# EasyEDA Pro project CH585M-R1(3)(1)(5).eprj, board CH585M-R1-1v1 (3)
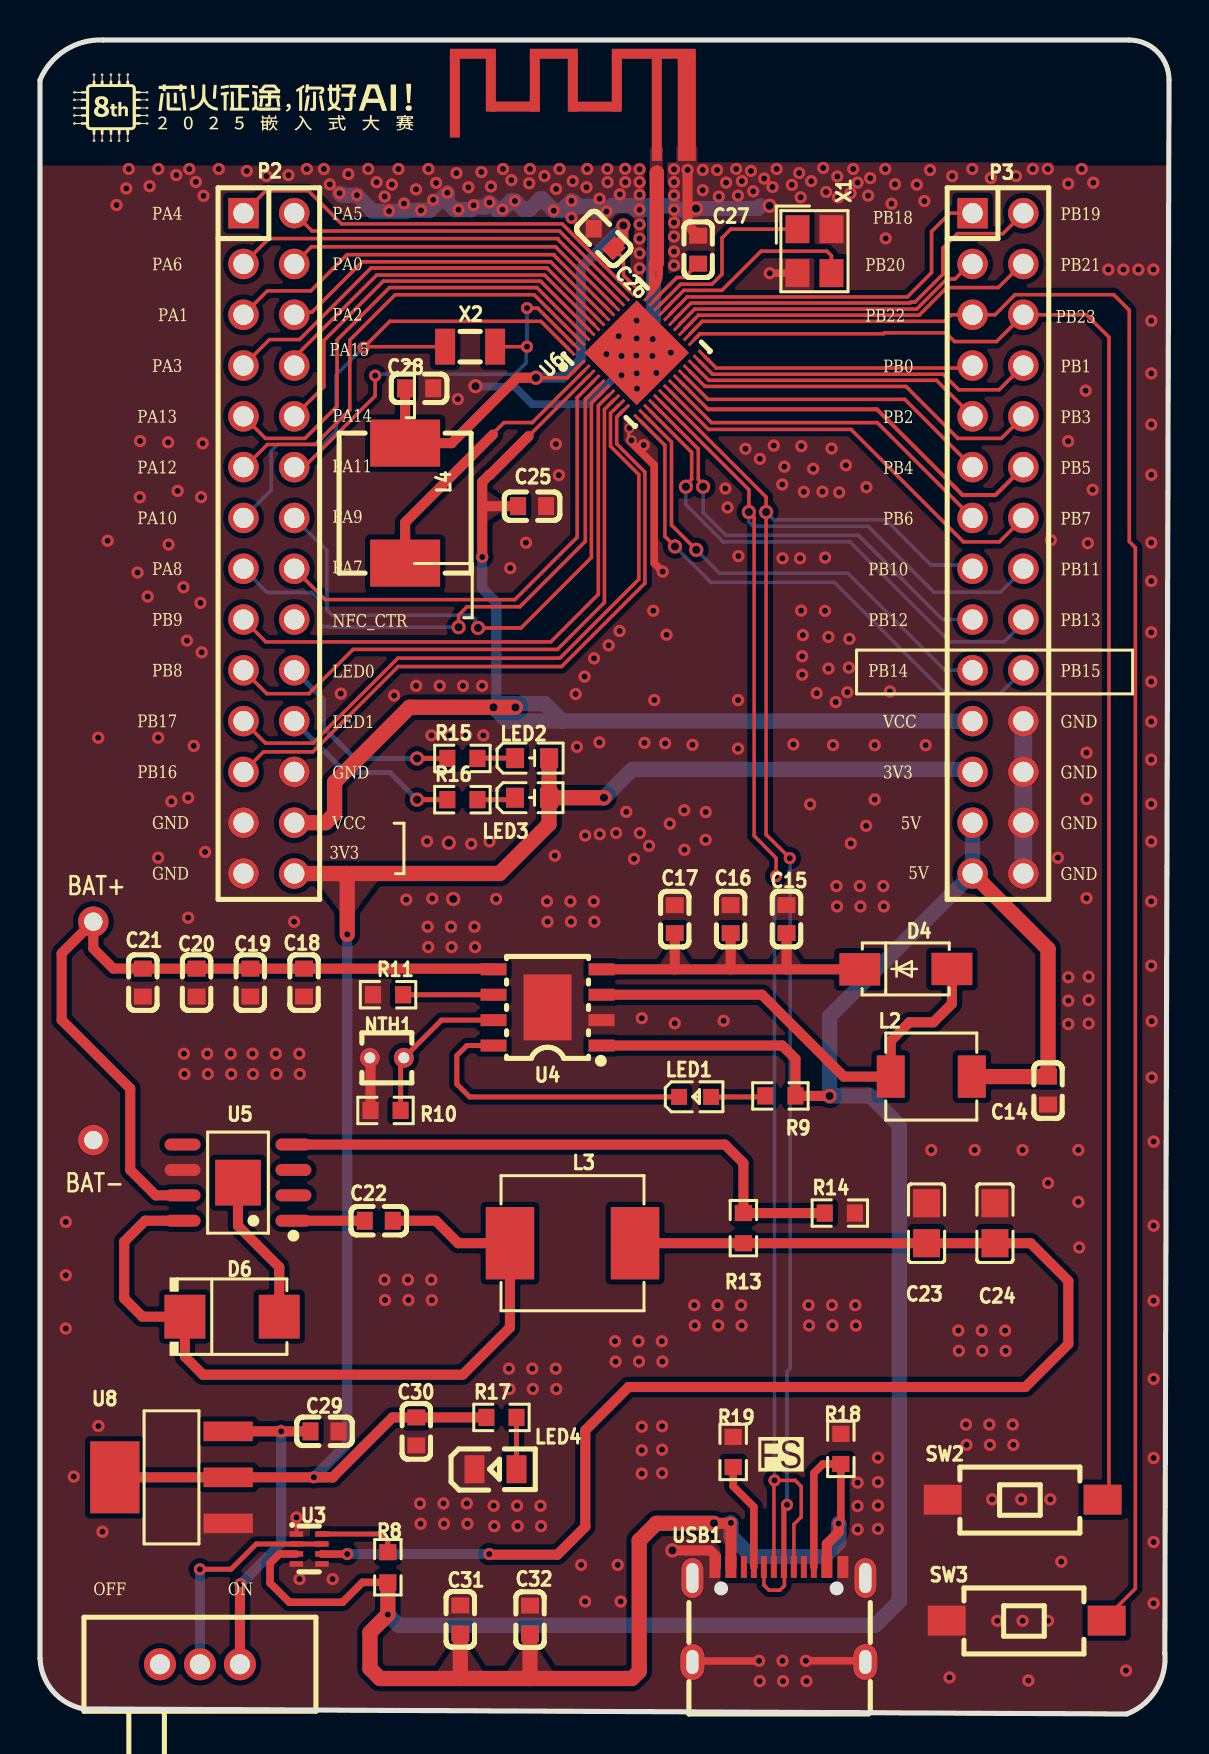
[diagram p4: board, top side]
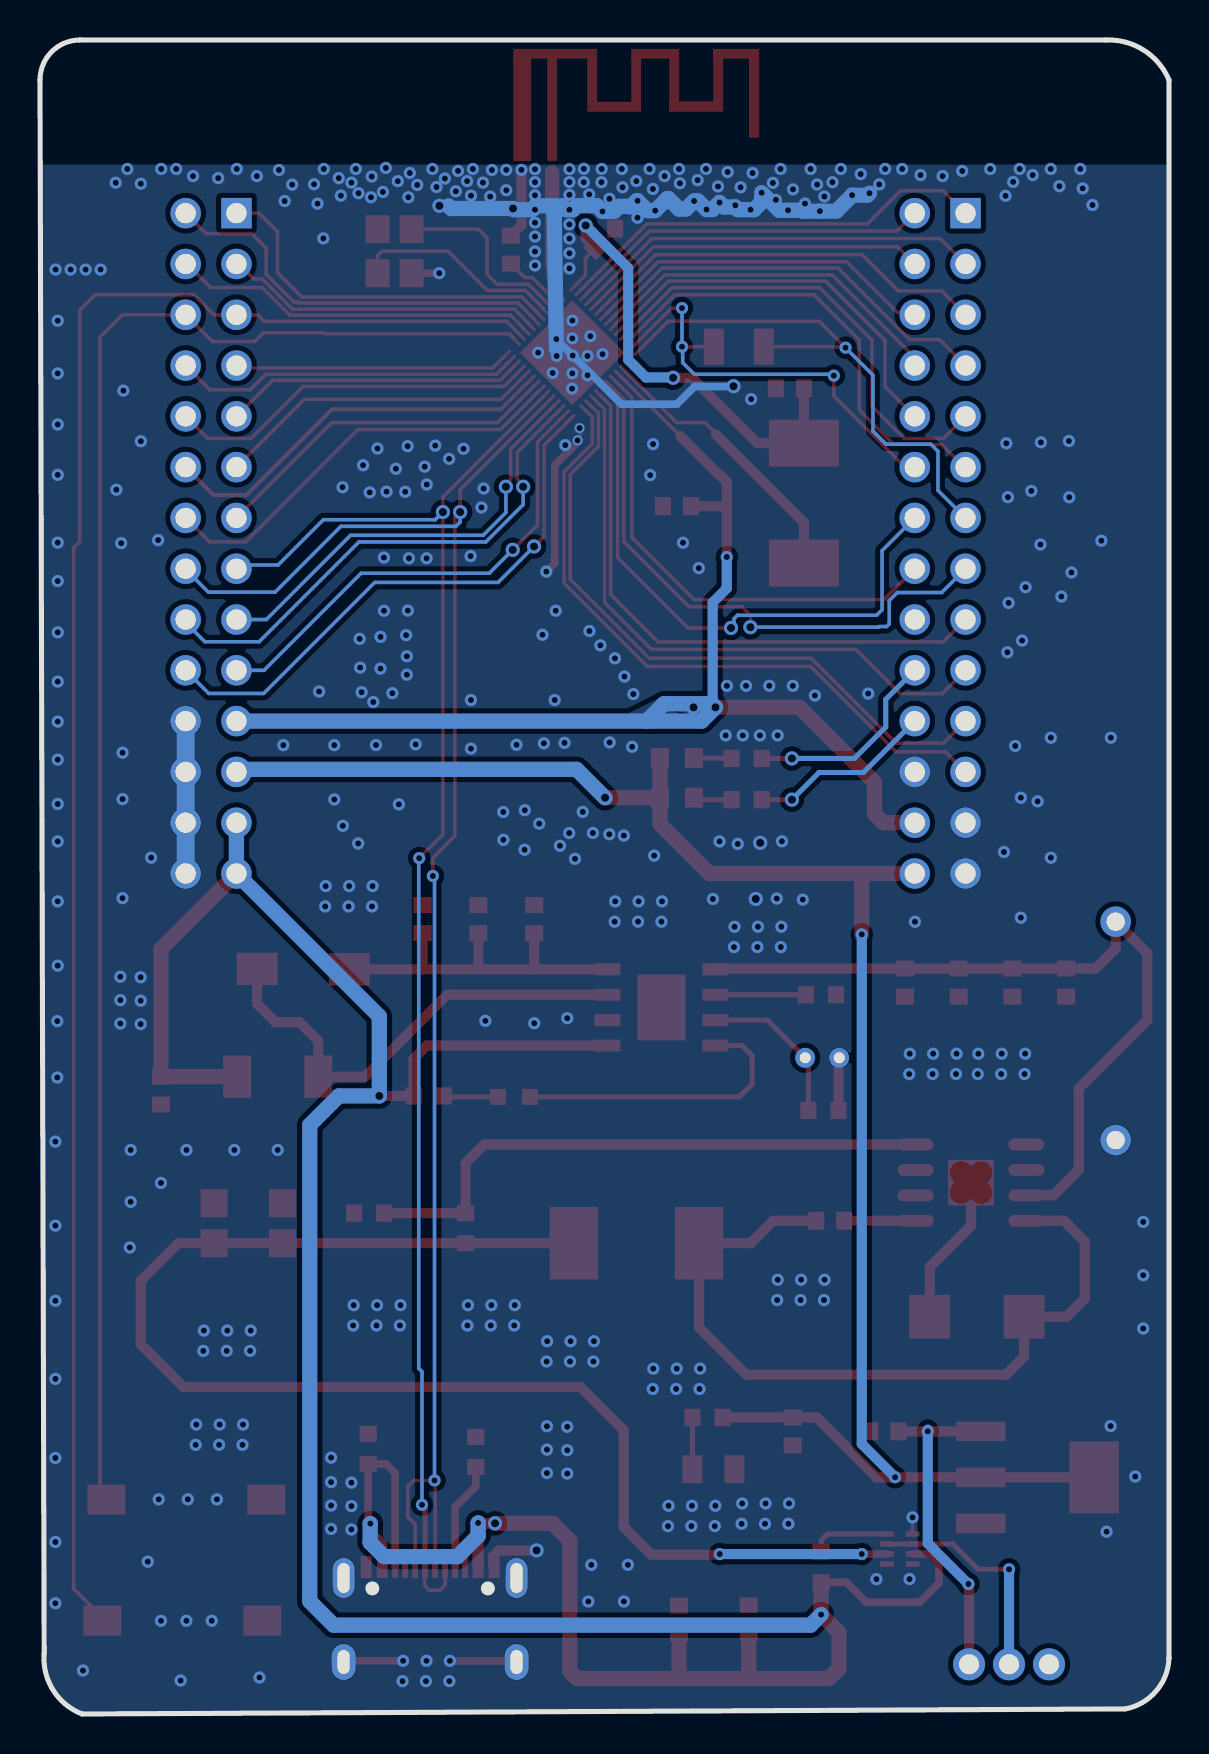
[diagram p5: board, bottom side, seen from below]

Outline 56.47 x 83.71 mm; copper layers: Top Layer, Bottom Layer. Coordinates in mm from the lower left corner of the outline.
Outline path: 0,81.71 arc(1.27,83.21) 3.16,83.71 54.47,83.71 arc(55.88,83.12) 56.47,81.71 56.26,3.05 arc(55.82,1.21) 54.36,0 2.18,0.25 arc(0.65,1.14) 0,2.79 0,81.71
Stack: Top Layer 0.0356mm / Dielectric1 0.32mm FR-4 er 4.8 / Bottom Layer 0.0356mm

## Design rules (mm)
net C3: CH585M-R1-1v1
net C5: CH585M-R1-1v1
net C7: CH585M-R1-1v1
net C8: CH585M-R1-1v1
net C11: CH585M-R1-1v1
net F1: CH585M-R1-1v1
net L1: CH585M-R1-1v1
net P2: CH585M-R1-1v1
net P3: CH585M-R1-1v1
net R1: CH585M-R1-1v1
net R2: CH585M-R1-1v1
net R3: CH585M-R1-1v1
net U1: CH585M-R1-1v1
net Y1: CH585M-R1-1v1
net Y2: CH585M-R1-1v1
net E1: CH585M-R1-1v1
net R4: CH585M-R1-1v1
net R7: CH585M-R1-1v1
net S1: CH585M-R1-1v1
net S2: CH585M-R1-1v1
net S3: CH585M-R1-1v1
net C1: CH585M-R1-1v1
net D1: CH585M-R1-1v1
net D2: CH585M-R1-1v1
net D3: CH585M-R1-1v1
net P4: CH585M-R1-1v1
net R8: CH585M-R1-1v1
net R11: CH585M-R1-1v1
net P1: CH585M-R1-1v1
net U2: CH585M-R1-1v1
net C4: CH585M-R1-1v1
net C6: CH585M-R1-1v1
net C9: CH585M-R1-1v1
net C10: CH585M-R1-1v1
net C12: CH585M-R1-1v1
net C13: CH585M-R1-1v1
net C14: CH585M-R1-1v1
net C15: CH585M-R1-1v1
net C16: CH585M-R1-1v1
net C17: CH585M-R1-1v1
net L2: CH585M-R1-1v1
net L3: CH585M-R1-1v1
net R12: CH585M-R1-1v1
net R13: CH585M-R1-1v1
net R14: CH585M-R1-1v1
net R15: CH585M-R1-1v1
net R16: CH585M-R1-1v1
net C2: CH585M-R1-1v1
net R17: CH585M-R1-1v1
net PB12: NewDifferentialPair2
net PB13: NewDifferentialPair2
net PB11: NewDifferentialPair1
net PB10: NewDifferentialPair1
spacing Clearance_1: track to track 0.152, other pairs 0.152 to 0.152
spacing Clearance (default): track to track 0.127, other pairs 0 to 0.152
spacing Clearance_3: track to track 0.254, other pairs 0 to 0.254
track width Width (default): min 0.127, default 0.178, max 1.27
differential pair DiffPairsRouting (default): width min 0.178, default 0.381, max 0.381; gap min 0.152, default 0.254
via RoutingVias (default): diameter min 0.508, default 0.61, max 1.27; hole min 0.305, default 0.305, max 0.711
net ANT uses Clearance_1

## Placement (name value [footprint] x y rotation side)
C14  100nF  [C0603#2]  50.42 31.17 90 top
C15  10uF  [C0603#2]  37.34 39.75 270 top
C16  10uF  [C0603#2]  34.54 39.75 270 top
C17  10uF  [C0603#2]  31.75 39.75 270 top
C18  10uF  [C0603#2]  13.21 36.57 90 top
C19  10uF  [C0603#2]  10.52 36.57 90 top
C20  10uF  [C0603#2]  7.83 36.57 90 top
C21  10uF  [C0603#2]  5.15 36.57 90 top
C22  100nF  [C0603#2]  16.95 24.67 0 top
C23  22uF  [C0805]  44.34 24.54 90 top
C24  22uF  [C0805]  47.76 24.54 90 top
C25  2.2uF  [C0603#2]  24.61 60.4 180 top
C26  100nF  [C0603]  28.19 73.78 135 top
C27  470nF  [C0603#2]  32.92 73.23 270 top
C28  4.7uF  [C0603#2]  18.96 66.29 180 top
C29  10uF  [C0603#2]  14.23 14.13 180 top
C30  22uF  [C0603#2]  18.82 14.13 90 top
C31  22uF  [C0603#2]  21.02 4.73 270 top
C32  22uF  [C0603#2]  24.51 4.72 270 top
D4  SS54  [SMA_L4.3-W2.6-LS5.0-FD]  43.31 37.25 180 top
D6  SS54SMB  [SMB_L4.6-W3.6-LS5.3-RD]  9.61 19.87 0 top
E1  F  [ANT-F-1-2.4G-1.6mmFR4]  30.86 77.98 0 top
L2  2.2uH  [IND-SMD_L4.4-W4.2]  44.58 31.87 0 top
L3  15uH  [IND-SMD_L7.0-W6.6_FXL0630]  26.64 23.54 180 top
L4  10uH  [IND-SMD_L7.3-W6.8]  18.26 60.55 90 top
LED1  LTST-C190KSKT  [LED0603-RD]  32.77 30.86 0 top
LED2  YLED0603B  [LED0603-FD]  24.61 45.82 180 top
LED3  YLED0603R  [LED0603-FD]  24.61 47.8 180 top
LED4  NCD0805R1  [LED0805-R-RD]  22.78 12.24 0 top
NOREF  -  [Pad_e2906]  2.67 39.62 0 top
NOREF#2  -  [Pad_e2948]  2.67 28.7 0 top
NTH1  100K  [RES-TH_L2.5-W2.5-P1.70-D0.3]  17.35 32.81 180 top
P2  HEADER 14x2  [IDC28-2.54MM]  10.18 75.05 0 top
P3  HEADER 14x2  [IDC28-2.54MM]  46.64 75.05 0 top
R8  10kΩ  [R0603]  17.4 7.34 270 top
R9  1kΩ  [R0603]  37.03 30.91 180 top
R10  82kΩ  [R0603]  17.28 30.18 180 top
R11  1kΩ  [R0603]  17.41 35.97 180 top
R13  10kΩ  [R0603]  35.18 24.3 90 top
R14  3.16kΩ  [R0603]  40.01 25.05 0 top
R15  1kΩ  [R0603]  21.13 47.78 0 top
R16  1kΩ  [R0603]  21.13 45.72 0 top
R17  1kΩ  [R0603]  23.08 14.83 0 top
R18  5.1kΩ  [R0603]  40.06 13.26 270 top
R19  5.1kΩ  [R0603]  34.67 13.1 270 top
SW1  SSSS916900  [SW-TH_SSSS916900]  8 2.49 90 top
SW2  TS-1101-C-W  [SW-SMD_L6.0-W3.3-LS8.0]  49.15 10.72 0 top
SW3  TS-1101-C-W  [SW-SMD_L6.0-W3.3-LS8.0]  49.35 4.67 0 top
U3  LM66200DRLR  [SOT-583-8_L2.1-W1.2-P0.50-LS1.6-BL]  13.46 8.25 270 top
U4  SCS5090EA  [ESOP-8_L4.9-W3.9-P1.27-LS6.0-BL-EP3.3]  25.39 35.33 90 top
U5  TPS5450DDAR  [SOP-8_L4.9-W3.9-P1.27-LS6.0-BL-EP]  9.9 26.57 90 top
U6  CH585M  [QFN-48_L5.0-W5.0-P0.35-TL-EP3.7-1]  29.85 68.07 45 top
U8  AMS1117-3.3  [SOT-223-4_L6.5-W3.5-P2.30-LS7.0-BR]  6.58 11.83 0 top
USB1  TYPE-C 16PIN 2MD(073)  [USB-C-SMD_TYPE-C-6PIN-2MD-073]  36.96 4.98 0 top
X1  32MHz  [CRYSTAL-SMD_4P-L3.2-W2.5-BL]  38.73 73.15 270 top
X2  32.768kHz  [FC-135R_L3.2-W1.5]  21.51 68.37 0 top

## Footprints (pads in the part's own frame, mm; a bottom-side part is the same pattern mirrored in y, then rotated)
ANT-F-1-2.4G-1.6mmFR4
  rect 0.8x0.6 smd: 0(1.483,0)
  rect 0.4x0.6 smd: 1(0,0)
C0603
  rect 0.8x0.9 smd: 1(-0.7,0)
  rect 0.8x0.9 smd rot 45: 2(0.7,0)
C0603#2
  rect 0.8x0.9 smd: 1(-0.7,0) 2(0.7,0)
C0805
  rect 1.41x1.35 smd: 1(-1,0) 2(1,0)
CRYSTAL-SMD_4P-L3.2-W2.5-BL
  rect 1.4x1.2 smd: 1(-1.1,-0.85) 2(1.1,-0.85) 3(1.1,0.85) 4(-1.1,0.85)
ESOP-8_L4.9-W3.9-P1.27-LS6.0-BL-EP3.3
  rect 0.6x1.3 smd: 1(-1.905,-2.7) 2(-0.635,-2.7) 3(0.635,-2.7) 4(1.905,-2.7) 5(1.905,2.7) 6(0.635,2.7) 7(-0.635,2.7) 8(-1.905,2.7)
  rect 3.3x2.4 smd: 9(0,0)
FC-135R_L3.2-W1.5
  rect 1x1.8 smd: 1(-1.25,0) 2(1.25,0)
IDC28-2.54MM
  rect 1.524x1.524 hole 1.016: 1(0,0)
  round 1.524 hole 1.016: 2(2.54,0) 3(0,-2.54) 4(2.54,-2.54) 5(0,-5.08) 6(2.54,-5.08) 7(0,-7.62) 8(2.54,-7.62) 9(0,-10.16) 10(2.54,-10.16) 11(0,-12.7) 12(2.54,-12.7) 13(0,-15.24) 14(2.54,-15.24) 15(0,-17.78) 16(2.54,-17.78) 17(0,-20.32) 18(2.54,-20.32) 19(0,-22.86) 20(2.54,-22.86) 21(0,-25.4) 22(2.54,-25.4) 23(0,-27.94) 24(2.54,-27.94) 25(0,-30.48) 26(2.54,-30.48) 27(0,-33.02) 28(2.54,-33.02)
IND-SMD_L4.4-W4.2
  rect 1.4x2.12 smd: 1(2.028,0) 2(-2.028,0)
IND-SMD_L7.0-W6.6_FXL0630
  rect 2.424x3.62 smd: 1(3.128,0) 2(-3.128,0)
IND-SMD_L7.3-W6.8
  rect 2.35x3.5 smd: 1(-3,0) 2(3,0)
LED0603-FD
  rect 0.9x1 smd: 1(-0.85,0) 2(0.85,0)
LED0603-RD
  rect 0.8x0.8 smd: 1(-0.799,0) 2(0.799,0)
LED0805-R-RD
  rect 1x1.399 smd: 1(1.05,0) 2(-1.05,0)
Pad_e2906
  round 1.524 hole 0.914: 1(0,0)
Pad_e2948
  round 1.524 hole 0.914: 1(0,0)
QFN-48_L5.0-W5.0-P0.35-TL-EP3.7-1
  rect 0.8x0.15 smd: 1(-2.5,1.575) 2(-2.5,1.225) 3(-2.5,0.875) 4(-2.5,0.525) 5(-2.5,0.175) 6(-2.5,-0.175) 7(-2.5,-0.525) 8(-2.5,-0.875) 9(-2.5,-1.225) 10(-2.5,-1.575) 25(2.5,-1.575) 26(2.5,-1.225) 27(2.5,-0.875) 28(2.5,-0.525) 29(2.5,-0.175) 30(2.5,0.175) 31(2.5,0.525) 32(2.5,0.875) 33(2.5,1.225) 34(2.5,1.575)
  rect 0.15x0.8 smd: 11(-2.275,-2.5) 12(-1.925,-2.5) 13(-1.575,-2.5) 14(-1.225,-2.5) 15(-0.875,-2.5) 16(-0.525,-2.5) 17(-0.175,-2.5) 18(0.175,-2.5) 19(0.525,-2.5) 20(0.875,-2.5) 21(1.225,-2.5) 22(1.575,-2.5) 23(1.925,-2.5) 24(2.275,-2.5) 35(2.275,2.5) 36(1.925,2.5) 37(1.575,2.5) 38(1.225,2.5) 39(0.875,2.5) 40(0.525,2.5) 41(0.175,2.5) 42(-0.175,2.5) 43(-0.525,2.5) 44(-0.875,2.5) 45(-1.225,2.5) 46(-1.575,2.5) 47(-1.925,2.5) 48(-2.275,2.5)
  rect 3.7x3.7 smd: 49(0.001,0)
R0603
  rect 0.806x0.864 smd: 1(-0.753,0) 2(0.753,0)
RES-TH_L2.5-W2.5-P1.70-D0.3
  round 1 hole 0.55: 1(-0.85,0) 2(0.85,0)
SMA_L4.3-W2.6-LS5.0-FD
  rect 2.046x1.62 smd: 1(-2.304,-0.009) 2(2.304,0.009)
SMB_L4.6-W3.6-LS5.3-RD
  rect 2.047x2.192 smd: 1(-2.361,0) 2(2.361,0)
SOP-8_L4.9-W3.9-P1.27-LS6.0-BL-EP
  oval 0.6x1.8 smd: 1(-1.905,-2.772) 2(-0.635,-2.772) 3(0.635,-2.772) 4(1.905,-2.772) 5(1.905,2.772) 6(0.635,2.772) 7(-0.635,2.772) 8(-1.905,2.772)
  rect 2.29x2.29 smd: 9(0,0)
SOT-223-4_L6.5-W3.5-P2.30-LS7.0-BR
  rect 2.47x0.98 smd: 1(2.835,-2.3) 2(2.835,0) 3(2.835,2.3)
  rect 2.47x3.6 smd: 4(-2.835,0)
SOT-583-8_L2.1-W1.2-P0.50-LS1.6-BL
  rect 0.28x0.68 smd: 1(-0.75,-0.64) 2(-0.25,-0.64) 3(0.25,-0.64) 4(0.75,-0.64) 5(0.75,0.64) 6(0.25,0.64) 7(-0.25,0.64) 8(-0.75,0.64)
SW-SMD_L6.0-W3.3-LS8.0
  rect 1.9x1.5 smd: 1(-4,0) 2(4,0)
SW-TH_SSSS916900
  round 1.6 hole 1: 1(0,2) 2(0,0) 3(0,-2)
USB-C-SMD_TYPE-C-6PIN-2MD-073
  rect 0.55x1.1 smd: 1(-3.2,2.375) 2(-2.4,2.375) 11(2.4,2.375) 12(3.2,2.375)
  rect 0.3x1.1 smd: 3(-1.75,2.375) 4(-1.25,2.375) 5(-0.75,2.375) 6(-0.25,2.375) 7(0.25,2.375) 8(0.75,2.375) 9(1.25,2.375) 10(1.75,2.375)
  oval 1.1x2 hole 0.6x1.5: 13(-4.325,1.825) 14(4.325,1.825)
  oval 1.2x1.8 hole 0.6x1.2: 13(-4.325,-2.375) 14(4.325,-2.375)

## Nets
As in the schematic, except:
GND: C14.1 C15.1 C16.1 C17.1 C18.1 C19.1 C20.1 C21.1 C23.2 C24.2 C25.1 C26.2 C27.1 C28.1 C29.1 C30.1 C31.1 C32.1 LED4.2 NOREF#2.1 NTH1.2 P2.24 P2.25 P2.27 P3.22 P3.24 P3.26 P3.28 R10.2 R11.2 R14.2 R18.1 R19.1 SW2.1 SW3.1 U3.1 U3.4 U3.5 U4.2 U4.9 U5.6 U6.49 U8.1 USB1.1 USB1.12 USB1.13 USB1.14 X1.2 X1.4
BAT+: C18.2 C19.2 C20.2 C21.2 NOREF.1 U4.5 U5.7

Pads without a net: E1 0; P2 17 18 19 21 23; SW1 1; U5 2 3 5; U6 7 8 9 10; USB1 3 9

## Via types
v1: diameter 0.711, hole 0.406, Top Layer to Bottom Layer, 23 vias
v2: diameter 0.61, hole 0.305, Top Layer to Bottom Layer, 445 vias
v3: diameter 0.508, hole 0.305, Top Layer to Bottom Layer, 2 vias

## Routing (per net, layer and track width the routed paths; a pad name or vN(x,y) marks a point on that pad's centre or on a via; arc(x,y) is an arc through that point)
+3V3: length 90.6
  Top Layer w0.508: 14.64,11.84 14.65,11.84 14.66,11.83 U8.2 U8.4 ; 14.64,11.84 17.63,14.83 C30.2 R17.1 ; 14.64,11.84 v2(13.7,11.84)
  Top Layer w0.762: 15.34,42.03 15.37,42.01 v2(15.37,38.99) ; 15.34,42.03 P2.28 ; 15.34,42.03 22.99,42.03 25.46,44.5 LED2.1 ; LED2.1 25.46,47.8 LED3.1 ; LED2.1 28.2,45.82 28.21,45.82
  Bottom Layer w0.508: v2(15.37,38.99) 15.37,13.51 v2(13.7,11.84)
  Bottom Layer w0.762: 28.21,45.82 29.63,47.24 46.52,47.24 P3.23
  vias: v1(28.21,45.82)
+5V: length 165
  Top Layer w0.381: R8.2 16.13,6.58 15.13,5.59 12.47,5.59 11.5,6.56 11.5,7.53 11.98,8 U3.3 ; v2(39.95,9.52) 40.06,9.63 R18.2 39.16,12.5 38.71,12.05 USB1.10
  Top Layer w0.508: v1(39.5,30.91) R9.1 37.79,32.76 37.12,33.43 U4.1 ; USB1.11 39.36,8.5 39.95,9.09 v2(39.95,9.52)
  Top Layer w0.559: USB1.2 v2(34.56,9.56) 34.54,9.54 v1(33.71,9.54)
  Top Layer w0.762: R8.2 v2(17.4,4.97) 16.51,4.08 16.51,2.28 17.01,1.78 21.05,1.78 ; v1(33.71,9.54) 30.83,9.54 29.97,8.68 29.97,2.13 29.61,1.78 24.51,1.78 ; 24.51,3.81 24.51,1.78 24.51,1.78 ; 24.51,1.78 21.05,1.78 ; 21.05,1.78 21.02,1.8 C31.2 ; L2.1 C14.2 50.42,38.26 P3.27
  Bottom Layer w0.762: P3.25 P3.27 39.5,34.88 v1(39.5,30.91) 41.52,30.91 42.98,29.45 42.98,5.64 41.78,4.44 17.93,4.44 v2(17.4,4.97) ; v2(39.95,9.52) 39.96,9.51 39.96,8.57 39.25,7.87 35.59,7.87 34.56,8.91 34.56,9.55 34.55,9.56
GND: length 75
  Top Layer w0.178: v2(12.83,9.83) 12.83,9.01 U3.1 ; 29.45,63.72 29.45,64.29 29.46,64.3
  Top Layer w0.381: USB1.14 41.22,2.66 v2(38.31,2.66) ; 20.65,40.78 v1(20.67,40.76) ; 32.73,2.65 35.96,2.65 v2(35.97,2.66) ; 29.48,63.69 30.72,62.45 30.72,57.55 v2(31.14,57.13) ; X1.2 v2(36.5,72.05)
  Top Layer w0.508: C27.1 32.39,74.45 v2(32.39,77.21) ; NTH1.2 16.53,32.78 R10.2 ; v1(31.63,8.18) 33.52,8.18 33.8,7.9 33.8,7.35
  Bottom Layer w0.381: v1(21.78,66.4) 21.8,66.38 23.73,66.38 24.62,65.5 27.39,65.5 v2(29.83,67.93) v2(30.65,68.75)
  Bottom Layer w0.762: 30.33,75.42 30.14,75.22 29.81,75.22 29.6,75.43 28.63,75.43 v2(28.33,75.14) 27.75,75.14 27.5,75.39 26.96,75.39 ; 30.33,75.42 31.68,75.42 31.88,75.22 32.75,75.22 v1(32.81,75.28) 35.9,75.28 36.04,75.42 ; 30.33,75.42 30.75,75 30.64,68.29 ; 20.37,75.85 20.37,75.6 20.75,75.23 v2(20.93,75.23) 21.56,75.23 21.69,75.36 22.26,75.36 v2(22.48,75.59) 22.84,75.23 v2(23.13,75.23) 23.56,75.66 v2(23.76,75.66) 24.16,75.25 24.51,75.25 25.03,75.77 25.11,75.77 v2(25.7,75.18) 26.09,75.18 v2(26.58,75.67) 26.63,75.67 26.94,75.36 ; v2(20.37,76.07) 19.5,75.2 v2(19.05,75.2) 18.37,75.2 18.33,75.15 v2(17.46,75.15) 16.64,75.15 15.85,75.94 v2(15.85,75.95) 15.08,75.95 v2(14.98,76.05)
  Bottom Layer w0.889: 49.18,49.65 49.18,42.03
  vias: v1(20.45,43.56) v1(36.49,75.42) v2(1.29,24.61) v2(1.29,21.94) v2(1.29,19.28) v2(1.69,11.87) v2(2.91,48.82) v2(2.92,14.4) v2(3.12,9.12) v2(3.38,58.67) v2(3.83,75.46) v2(4.32,76.29) v2(4.44,77.26) v2(4.88,57.08) v2(5.01,63.66) v2(4.99,60.85) v2(5.39,55.88) v2(5.48,76.4) v2(5.92,77.26) v2(5.91,48.82) v2(5.91,42.82) v2(6.41,63.59) v2(6.43,58.48) v2(6.57,45.64) v2(6.82,76.95) v2(6.89,61.16) v2(7.17,56.35) v2(7.2,33.02) v2(7.23,32) v2(7.35,53.68) v2(7.41,45.82) v2(7.41,39.82) v2(7.47,77.26) v2(7.69,48.41) v2(7.8,76.61) v2(8.06,60.85) v2(8.02,55.56) v2(8.09,53.09) v2(8.18,75.92) v2(8.14,63.54) v2(8.26,43.11) v2(8.37,33.02) v2(8.4,32) v2(8.94,77.26) v2(9.54,33.02) v2(9.57,32) v2(10.34,77.16) v2(10.63,33.02) v2(10.65,32) v2(11.32,76.9) v2(11.8,33.02) v2(11.83,32) v2(12.43,76.95) v2(12.71,39.62) v2(12.97,33.02) v2(13,32) v2(12.98,6.75) v2(13.35,77.26) v2(14.2,77.26) v2(14.49,76.49) v2(14.64,6.75) v2(15.05,51.03) v2(15.42,77.01) v2(16.42,77.26) v2(16.83,76.6) v2(17.24,75.88) v2(17.23,21.72) v2(17.26,20.7) v2(17.6,76.48) v2(17.71,50.93) v2(17.93,77.26) v2(18.21,75.53) v2(18.32,40.72) v2(18.4,21.72) v2(18.43,20.7) v2(18.81,76.24) v2(18.81,51.41) v2(19.01,10.53) v2(19.04,9.51) v2(19.36,43.64) v2(19.39,39.37) v2(19.42,38.35) v2(19.43,77.26) v2(19.58,48.94) v2(19.62,40.78) v2(19.57,21.71) v2(19.6,20.7) v2(19.66,75.72) v2(19.81,76.56) v2(19.99,51.41) v2(20.18,10.53) v2(20.21,9.51) v2(20.46,48.94) v2(20.56,39.37) v2(20.59,38.35) v2(20.83,77.06) v2(20.9,65.75) v2(21.16,51.41) v2(21.32,48.94) v2(21.35,10.53) v2(21.38,9.51) v2(21.43,76.35) v2(21.57,43.51) v2(21.69,75.45) v2(21.73,39.37) v2(21.76,38.35) v2(22.08,77.11) v2(22.11,51.41) v2(22.17,48.94) v2(22.48,43.63) v2(22.56,76.39) v2(22.69,10.41) v2(22.72,9.4) v2(22.81,40.75) v2(23.16,77.26) v2(23.52,57.3) v2(23.45,17.27) v2(23.48,16.25) v2(23.58,76.7) v2(23.86,10.41) v2(23.89,9.4) v2(24.31,58.57) v2(24.51,77.26) v2(24.47,76.54) v2(24.62,17.27) v2(24.65,16.25) v2(25.03,10.41) v2(25.06,9.39) v2(25.23,76.9) v2(25.36,40.64) v2(25.39,39.62) v2(25.81,76.26) v2(25.8,63.5) v2(25.75,42.92) v2(25.8,17.27) v2(25.82,16.25) v2(25.98,77.26) v2(25.95,61.95) v2(26.59,74.82) v2(26.53,40.64) v2(26.56,39.62) v2(26.64,76.65) v2(26.79,51) v2(26.86,48.36) v2(27.07,7.46) v2(27.24,51.88) v2(27.27,43.93) v2(27.26,5.63) v2(27.37,77.26) v2(27.33,76.35) v2(27.71,52.79) v2(27.7,40.64) v2(27.73,39.62) v2(27.99,75.77) v2(27.98,48.58) v2(28,43.99) v2(28.38,77.26) v2(28.39,76.6) v2(28.33,68) v2(28.44,53.44) v2(28.82,44.06) v2(28.76,18.64) v2(28.79,17.63) v2(28.89,7.46) v2(29,75.99) v2(28.94,68.9) v2(28.99,54.16) v2(29.09,67.91) v2(29.09,66.94) v2(29.04,5.63) v2(29.27,77.27) v2(29.27,76.6) v2(29.32,45.11) v2(29.71,42.76) v2(29.84,69.68) v2(29.85,68.79) v2(29.85,67.04) v2(29.86,66.28) v2(29.99,77.25) v2(29.99,76.6) v2(29.99,75.97) v2(29.99,75.22) v2(29.99,74.49) v2(29.99,73.78) v2(29.99,73.05) v2(29.99,72.29) v2(30,44.05) v2(29.93,18.64) v2(29.96,17.63) v2(30.1,34.8) v2(30.1,14.36) v2(30.1,13.19) v2(30.1,12.02) v2(30.2,63.45) v2(30.23,48.56) v2(30.46,43.42) v2(30.63,67.91) v2(30.68,55.17) v2(30.73,50.7) v2(30.83,67.06) v2(31.1,18.64) v2(31.12,14.39) v2(31.11,13.22) v2(31.11,12.05) v2(31.13,17.62) v2(31.27,48.54) v2(31.34,53.97) v2(31.5,44.52) v2(31.55,68.08) v2(31.71,77.25) v2(31.71,76.6) v2(31.71,75.94) v2(31.71,75.22) v2(31.71,74.58) v2(31.71,73.88) v2(31.71,73.13) v2(31.71,72.44) v2(31.75,34.54) v2(32.22,45.19) v2(32.23,43.22) v2(32.64,48.47) v2(32.72,20.45) v2(32.75,19.43) v2(33.15,77.21) v2(33.15,76.2) v2(33.3,45.1) v2(33.29,43.71) v2(33.87,77.21) v2(33.89,20.45) v2(33.95,75.88) v2(33.92,19.43) v2(34.19,34.66) v2(34.32,76.58) v2(34.28,61.28) v2(34.39,60.33) v2(34.82,77.26) v2(34.91,75.93) v2(34.92,50.7) v2(34.92,48.27) v2(34.93,57.9) v2(35.11,76.65) v2(35.07,20.44) v2(35.09,19.43) v2(35.29,63.27) v2(35.56,77.16) v2(35.67,76.14) v2(36.01,62.76) v2(36,1.64) v2(36.22,76.78) v2(36.64,76.36) v2(36.7,63.43) v2(36.84,77.26) v2(37.13,61.48) v2(37.14,57.79) v2(37.14,2.66) v2(37.17,1.64) v2(37.23,62.37) v2(37.6,76.46) v2(37.68,48.49) v2(37.97,77.06) v2(38.02,57.79) v2(38.05,75.85) v2(38.08,63.4) v2(38.07,55.18) v2(38.12,52.89) v2(38.12,51.97) v2(38.2,61.12) v2(38.16,53.95) v2(38.34,1.64) v2(38.52,45.49) v2(38.44,20.45) v2(38.47,19.43) v2(38.57,76.65) v2(38.67,62.27) v2(38.85,51.05) v2(39.17,77.31) v2(39.14,61.13) v2(39.32,76.11) v2(39.27,57.83) v2(39.26,55.17) v2(39.44,53.86) v2(39.44,52.28) v2(39.59,63.28) v2(39.61,20.45) v2(39.66,48.46) v2(39.64,19.43) v2(39.8,50.6) v2(39.88,76.88) v2(39.92,75.85) v2(39.84,41.4) v2(39.86,40.38) v2(39.98,61.09) v2(40.31,62.45) v2(40.38,51.1) v2(40.48,53.76) v2(40.46,52.33) v2(40.54,76.05) v2(40.55,43.53) v2(40.67,77.26) v2(40.78,20.44) v2(40.81,19.43) v2(40.89,76.58) v2(40.89,11.57) v2(40.89,10.4) v2(40.89,9.23) v2(41.01,41.4) v2(41.04,40.38) v2(41.32,44.41) v2(41.42,75.93) v2(41.34,61.35) v2(41.53,76.8) v2(41.75,48.45) v2(41.75,45.73) v2(41.91,12.82) v2(41.91,11.6) v2(41.91,10.43) v2(41.91,9.25) v2(42.18,41.4) v2(42.21,40.38) v2(42.28,77.26) v2(42.3,73.79) v2(42.51,51.13) v2(42.59,75.53) v2(42.76,76.5) v2(43.86,76.48) v2(44.23,75.66) v2(44.3,48.45) v2(44.52,77.21) v2(44.58,28.2) v2(45.49,1.83) v2(45.62,76.9) v2(45.93,19.18) v2(45.96,18.16) v2(46.31,14.48) v2(46.34,13.46) v2(46.63,77.26) v2(46.75,28.2) v2(47.1,19.18) v2(47.13,18.16) v2(47.48,14.48) v2(47.51,13.46) v2(47.56,76.8) v2(47.62,10.73) v2(47.88,4.66) v2(48.27,19.17) v2(48.3,18.16) v2(48.66,14.47) v2(48.68,13.46) v2(48.82,76.9) v2(49.08,10.73) v2(49.15,28.2) v2(49.15,4.66) v2(49.44,1.67) v2(49.66,77.26) v2(50.41,77.26) v2(50.42,26.56) v2(50.42,4.66) v2(50.56,58.7) v2(50.53,10.73) v2(50.91,42.82) v2(51.08,7.62) v2(51.43,76.52) v2(51.42,63.65) v2(51.44,36.84) v2(51.43,35.67) v2(51.43,34.5) v2(51.94,28.2) v2(51.94,25.61) v2(51.98,23.33) v2(52.1,77.26) v2(52.3,66.18) v2(52.41,58.55) v2(52.34,48.07) v2(52.34,45.75) v2(52.34,40.8) v2(52.45,36.87) v2(52.45,35.7) v2(52.45,34.53) v2(52.68,76.57) v2(52.65,61.22) v2(53.44,72.23) v2(54.19,72.23) v2(54.32,2.17) v2(54.94,72.23) v2(55.58,69.67) v2(55.58,67.04) v2(55.58,64.48) v2(55.58,61.97) v2(55.58,58.58) v2(55.58,56.65) v2(55.58,54.09) v2(55.58,51.62) v2(55.58,49.63) v2(55.58,47.72) v2(55.58,45.51) v2(55.58,43.63) v2(55.58,40.64) v2(55.58,37.42) v2(55.61,34.65) v2(55.61,31.83) v2(55.69,72.23) v2(55.7,28.62) v2(55.7,24.42) v2(55.7,20.66) v2(55.7,16.76) v2(55.7,12.8) v2(55.7,8.6) v2(55.7,5.54) v3(29.48,64.3) v3(29.58,63.69)
V5V: length 16.7
  Top Layer w0.508: SW1.3 10,6.47 v2(10.03,6.5) ; v2(12.07,14.13) C29.2 ; 11.98,14.13 U8.3 ; 12.07,14.18 12.04,14.16 11.98,14.09
  Bottom Layer w0.508: 12.07,14.22 12.07,8.53 v2(10.03,6.5)
VCC: length 63.3
  Top Layer w0.178: U6.3 24.44,63.9
  Top Layer w0.508: 22.12,60.24 v2(22.12,57.86) ; 22.12,60.24 22.28,60.4 C25.2 ; 22.12,60.24 22.12,61.61 22.48,61.97 22.51,61.97 24.44,63.9
  Top Layer w0.762: P2.26 14.29,44.57 14.73,45.02 14.73,46.6 18.48,50.34 v1(22.68,50.34) 22.69,50.34 v1(23.78,50.34)
  Bottom Layer w0.508: v2(22.12,57.86) 22.12,56.29 22.83,55.58 22.83,50.56 22.86,50.52
  Bottom Layer w0.762: 26.13,49.65 25.26,50.52 22.86,50.52 v1(22.68,50.34) 23.37,49.65 26.13,49.65 ; 26.13,49.65 P3.21
VINTA: length 2.5
  Top Layer w0.178: 30.77,70.75 31.86,71.83 32.23,71.83 32.62,72.23 32.64,72.23
(no net): length 126.6
  Top Layer w0.178: 29.19,65.2 28.84,64.86 28.84,63.52 30.26,62.1 30.26,56.54 26.09,52.38 17.91,52.38 13.65,48.11 11.18,48.11 P2.23 ; 28.44,65.95 27.93,65.43 27.93,55.99 25.55,53.61 11.3,53.61 P2.17 ; P2.19 11.35,51.02 13.45,51.02 15.66,53.24 25.88,53.24 28.23,55.59 28.23,65.24 28.69,65.7 ; P2.21 11.28,48.55 13.65,48.55 17.9,52.8 26,52.8 29.95,56.75 29.95,61.98 28.54,63.39 28.54,65.05 28.94,65.45
ANT: length 13.4
  Top Layer w0.178: 30.92,72.4 30.8,72.52 ; 30.92,72.4 30.93,72.39 30.93,71.81 30.91,71.78 ; 30.92,72.4 30.92,71.96 arc(30.92,71.87) 30.91,71.78 ; 30.52,70.99 30.71,71.19 arc(30.98,71.58) 31.07,72.05 31.07,73.32 ; 30.52,70.99 arc(30.53,71) 30.54,71.01 ; 30.52,70.99 arc(30.73,71.31) 30.8,71.68 30.91,71.78 ; 30.52,70.99 arc(30.53,71.01) 30.54,71.03 30.54,72.5 ; 30.52,70.99 arc(30.78,71.36) 30.91,71.78 ; 30.52,70.99 arc(30.53,71) 30.54,71.01 ; 30.52,70.99 arc(30.53,71) 30.54,71.01 ; 30.52,70.99 arc(30.65,71.19) 30.7,71.43 30.7,72.47
  Top Layer w0.714: 30.86,77.08 30.85,77.08 30.85,72.57 30.8,72.52
BAT+: length 39.4
  Top Layer w0.508: U4.5 22.65,37.27 C18.2 C19.2 C20.2 C21.2 5.14,37.28 3.67,37.28 2.67,38.28 NOREF.1 1.08,38.04 1.08,34.71 4.51,31.28 4.51,27.21 5.79,25.94 U5.7
BATO: length 70.1
  Top Layer w0.381: v2(15.37,8) 14.11,8 U3.6
  Top Layer w0.508: L3.2 R13.1 C23.1 C24.1 49.55,23.54 51.43,21.66 51.43,18.5 49.29,16.35 29.44,16.35 27.27,14.19 27.27,9.36 25.88,7.97 22.47,7.97
  Bottom Layer w0.508: v2(15.37,8) 22.44,8 22.47,7.97
  vias: v2(22.47,8)
BOOT: length 89.4
  Top Layer w0.178: 53.21,4.7 54.79,6.27 54.79,58.33 54.48,58.63 54.48,70.2 53.7,70.97 48.77,70.97 47.77,69.97 P3.5 45.58,69.97 45.25,69.64 33.13,69.64 32.5,69.01
EP: length 39.8
  Top Layer w0.508: C22.2 19.8,24.67 20.92,23.54 L3.1 23.51,19.33 21.15,16.97 8.15,16.97 7.25,17.87 D6.1 5.12,19.87 4.21,20.78 4.21,23.62 5.26,24.67 U5.8
FB: length 29.5
  Top Layer w0.508: U5.4 34.26,28.48 35.18,27.55 R13.2 R14.1
LED0: length 10.3
  Top Layer w0.254: v1(18.86,47.78) R15.1
  Bottom Layer w0.254: v1(18.86,47.78) 15.74,47.78 14.17,49.35 14.17,50.74 P2.20
LED1: length 9.3
  Top Layer w0.254: v1(18.86,45.72) R16.1
  Bottom Layer w0.254: v1(18.86,45.72) 17.51,47.08 15.29,47.08 P2.22
LX: length 23.5
  Top Layer w0.508: 45.61,37.26 45.61,35.52 44.68,34.59 43.48,34.59 42.55,33.66 L2.2 40.2,31.87 36.11,35.97 U4.3
PA0: length 17.5
  Top Layer w0.178: 28.69,70.47 25.78,73.37 13.58,73.37 P2.4
PA1: length 20.7
  Top Layer w0.178: 28.44,70.22 25.72,72.94 25.72,72.98 15.36,72.98 13.54,71.16 11.37,71.16 P2.5
PA2: length 17.7
  Top Layer w0.178: 28.19,69.97 25.54,72.62 16.12,72.62 13.6,70.1 12.85,70.1 P2.6
PA3: length 20.9
  Top Layer w0.178: P2.7 11.48,68.73 12.98,68.73 16.56,72.31 25.36,72.31 27.94,69.72
PA4: length 21.8
  Top Layer w0.178: 29.43,71.21 26.12,74.51 15.08,74.51 13.42,76.17 11.3,76.17 P2.1
PA5: length 18.2
  Top Layer w0.178: 29.18,70.96 25.98,74.16 13.61,74.16 P2.2
PA6: length 20.6
  Top Layer w0.178: P2.3 11.45,73.78 25.9,73.78 25.9,73.74 28.93,70.71
PA7: length 24.2
  Top Layer w0.178: P2.16 14.26,55.72 23.75,55.72 26.87,58.85 26.87,65.83 27.7,66.66
PA8: length 29.2
  Top Layer w0.178: v1(20.94,54.35) 20.94,54.95 21.36,55.37 24,55.37 27.28,58.64 27.28,65.75 U6.5
  Bottom Layer w0.178: v1(20.94,54.35) 14.52,54.35 14.49,54.38 14.12,54.38 14,54.51 14,55.67 13.59,56.08 11.37,56.08 P2.15
PA9: length 29.1
  Top Layer w0.178: U6.6 27.58,65.56 27.58,57.83 24.06,54.31 v1(21.91,54.31)
  Bottom Layer w0.178: P2.14 14.35,58.18 14.35,55.22 14.62,54.94 21.58,54.94 21.76,54.77 21.76,54.46 v1(21.91,54.31)
PA10: length 27.8
  Top Layer w0.178: 20.26,68.37 16.23,68.37 17.5,69.64 25.05,69.64 26.47,68.23
  Top Layer w0.508: 16.23,68.37 v2(16.18,68.32)
  Bottom Layer w0.178: P2.13 11.56,61.19 11.56,63.14 11.91,63.5 14.15,63.5 14.81,64.16 14.81,66.95 v2(16.18,68.32)
PA11: length 21.8
  Top Layer w0.178: v2(16.76,66.93) 16.76,65.91 13.2,62.35 P2.12 ; 22.76,68.37 24.3,68.37 24.32,68.4 ; v2(24.36,70.3) 24.89,70.3 U6.47
  Bottom Layer w0.178: v2(16.76,66.93) 16.83,66.99 23.74,66.99 24.32,67.58 24.32,68.4 24.36,68.44 v2(24.36,70.3)
  vias: v2(24.36,68.37)
PA12: length 23.3
  Top Layer w0.178: 10.24,62.35 11.37,63.48 13.76,63.48 15.49,65.21 15.49,68.7 17.76,70.97 24.72,70.97 26.95,68.73
PA13: length 23.5
  Top Layer w0.178: P2.9 11.28,63.79 13.25,63.79 14.86,65.4 14.86,68.7 17.48,71.33 24.85,71.33 27.2,68.98
PA14: length 19.9
  Top Layer w0.178: P2.10 14.2,66.37 14.2,68.68 17.17,71.65 25.03,71.65 27.45,69.24 27.45,69.23
PA15: length 18.1
  Top Layer w0.178: 27.7,69.48 27.7,69.49 25.23,71.96 16.84,71.96 12.72,67.83 P2.8
PB0: length 13.7
  Top Layer w0.178: P3.7 46.52,67.31 33.82,67.31 33.23,67.9
PB1: length 17.3
  Top Layer w0.178: 32.98,67.65 33.64,67 45.18,67 45.95,66.22 47.97,66.22 49.18,67.43
PB2: length 14.9
  Top Layer w0.178: P3.9 44.84,66.69 33.45,66.69 32.74,67.41
PB3: length 18.5
  Top Layer w0.178: 49.18,64.89 48.08,63.79 45.91,63.79 43.31,66.39 33.26,66.39 32.49,67.16
PB4: length 16.3
  Top Layer w0.178: P3.11 43.25,65.74 33.41,65.74 32.24,66.91
PB5: length 20.1
  Top Layer w0.178: 33.45,65.24 33.41,65.24 32.51,66.14 32.51,66.15 32.2,66.47 32.19,66.47 31.99,66.66
  Top Layer w0.203: 49.18,62.35 47.79,60.96 46.15,60.96 41.86,65.24 33.45,65.24
PB6: length 17.6
  Top Layer w0.178: 31.75,66.42 33.59,64.57 41.88,64.57 P3.13
PB7: length 21.3
  Top Layer w0.178: 49.18,59.81 47.99,58.62 46.19,58.62 40.56,64.24 33.43,64.24 31.5,66.17
PB10: length 75.9
  Top Layer w0.178: 31.25,65.92 36.32,60.85 v1(36.32,60.1) 36.32,43.98 v2(37.5,42.8) ; USB1.5 36.21,6.45 36.46,6.19 37.01,6.19 37.23,6.42 37.23,7.32 USB1.7
  Top Layer w0.254: USB1.7 37.21,10.31 v2(37.36,10.46)
  Bottom Layer w0.178: P3.15 46.46,57.46 44.56,57.46 42.29,59.72 36.7,59.72 v1(36.32,60.1) ; v2(37.36,10.46) 37.36,17.12 37.53,17.28 37.53,42.77 v2(37.5,42.8)
PB11: length 82.6
  Top Layer w0.178: v2(36.82,41.91) 36.82,42.8 35.72,43.92 35.72,59.84 v1(35.45,60.1) 35.45,61.22 31,65.67 ; USB1.8 37.71,9.48 38.07,9.85 38.07,11.38 37.77,11.68 v2(36.74,11.68) 36.71,11.65 USB1.6
  Bottom Layer w0.178: 49.18,57.27 49.18,57.24 48.04,56.1 44.71,56.1 41.42,59.39 35.67,59.39 35.45,59.61 v1(35.45,60.1) 35.45,60.13 ; v2(36.74,11.68) 36.74,41.83 v2(36.82,41.91)
PB12: length 22.1
  Top Layer w0.178: v1(33.17,61.37) 33.17,61.5 32.93,61.74 32.93,63.28 32.9,63.28 30.76,65.43
  Bottom Layer w0.178: P3.17 45.15,54.73 40.94,58.94 34.3,58.94 33.17,60.08 v1(33.17,61.37)
PB13: length 26
  Top Layer w0.178: v1(32.3,61.37) 32.44,61.5 32.44,61.59 32.6,61.75 32.6,63.09 30.51,65.18
  Bottom Layer w0.178: v1(32.3,61.37) 32.3,60.47 34.17,58.61 40.52,58.61 45.51,53.62 48.22,53.62 49.18,54.58 49.18,54.73
PB14: length 24.1
  Top Layer w0.178: v1(32.83,58.21) 31.59,59.45 31.59,63.61 30.26,64.93
  Bottom Layer w0.178: P3.19 45.26,52.19 40.41,57.05 33.99,57.05 v1(32.83,58.21)
PB15: length 28
  Top Layer w0.178: 30.01,64.68 31.26,63.44 31.26,58.89 v1(31.76,58.38)
  Bottom Layer w0.178: v1(31.76,58.38) 33.56,56.58 39.73,56.58 45.28,51.03 48.03,51.03 49.18,52.19
PB18: length 18.4
  Top Layer w0.178: P3.1 45.51,75.05 44.59,74.13 44.59,72.07 43.38,70.86 32.37,70.86 31.51,70
PB19: length 20.4
  Top Layer w0.178: 31.76,69.76 32.56,70.56 43.51,70.56 43.56,70.61 43.77,70.61 45.16,71.99 45.16,73.3 45.88,74.03 48.16,74.03 49.18,75.05
PB20: length 15.9
  Top Layer w0.178: P3.3 46.52,72.51 45.77,71.76 45.36,71.76 43.85,70.25 32.75,70.25 32,69.51 32,69.51
PB21: length 18.3
  Top Layer w0.178: 49.18,72.51 49.11,72.51 47.93,71.33 45.36,71.33 43.97,69.95 32.94,69.95 32.25,69.27 32.25,69.26
PB23: length 80.3
  Top Layer w0.178: 53.47,36.7 53.47,10.92 53.21,10.67 ; 53.47,36.71 53.47,68.85 52.35,69.97 49.18,69.97 47.85,68.63 45.74,68.63 45.3,69.07 42.23,69.07 42.18,69.02 33,69.02 32.75,68.77
STAT: length 14.9
  Top Layer w0.254: U4.8 21.35,33.43 20.85,32.92 20.85,31.5 21.49,30.86 LED1.1
V_SYS: length 11.4
  Top Layer w0.254: U3.7 U3.2 10.82,8.5 9.55,7.24 8,7.24
  Bottom Layer w0.508: v2(8,7.24) SW1.2
VBS: length 18.4
  Top Layer w0.508: C15.2 37.34,37.24 37.35,37.24 ; U4.4 31.74,37.24 ; 31.74,37.24 34.53,37.24 ; 31.74,37.24 31.75,37.25 C17.2 ; C16.2 34.54,37.25 34.53,37.24 ; 34.53,37.24 37.35,37.24 ; 37.35,37.24 D4.2
VDCID: length 26.9
  Top Layer w0.178: C26.1 29.18,72.79 29.18,71.95 U6.35 ; v1(24.8,66.82) 26.37,66.82 U6.1
  Top Layer w0.508: v1(24.8,66.82) 23.86,66.82 20.59,63.55 L4.2 C28.2 ; C26.1 29.18,73.78 v1(29.18,74.44)
  Bottom Layer w0.508: v1(29.18,74.44) 27.05,72.31 27.05,67.72 26.16,66.84 24.82,66.84 v1(24.8,66.82)
VSW: length 14.2
  Top Layer w0.178: U6.2 24.62,64.58 23.21,64.58 22.66,64.03 22.66,63.98
  Top Layer w0.508: L4.1 18.26,59.59 22.66,63.98
X32MI: length 9.5
  Top Layer w0.178: X1.1 34.55,74.25 34.11,73.81 34.11,72 33.61,71.5 32.04,71.5 31.04,70.5 31.01,70.5
X32MO: length 10.5
  Top Layer w0.178: X1.3 39.58,72.92 39.36,73.15 36.07,73.15 34.11,71.19 32.2,71.19 31.26,70.25
$1N164: length 2.6
  Top Layer w0.254: R17.2 23.83,12.24
$1N5275: length 4
  Top Layer w0.254: R8.1 17.4,8.68 17.08,9 U3.8
$1N7704: length 2.7
  Top Layer w0.254: LED1.2 36.23,30.86 36.28,30.91
$1N7911: length 8
  Top Layer w0.254: U4.7 20.08,34.7 NTH1.1 18.04,32.65 R10.1
$1N8019: length 4.5
  Top Layer w0.254: R11.1 U4.6
$1N8947: length 3.6
  Top Layer w0.508: U5.1 C22.1
$1N8982: length 7.6
  Top Layer w0.508: U5.9 9.9,24.41 11.97,22.35 D6.2
$1N12468: length 1.9
  Top Layer w0.254: LED3.2 21.9,47.8
  Top Layer w0.508: 21.9,47.8 R15.2
$1N12470: length 1.9
  Top Layer w0.254: LED2.2 23.66,45.72 R16.2
$1N14257: length 5.4
  Top Layer w0.381: R19.2 34.67,11.39 35.71,10.35 USB1.4

## Copper pours and planes (outline as drawn; the poured copper is in the pictures)
+5V on Top Layer: 33.32,9.4 34.42,9.4 34.42,8.28 33.32,8.28
GND on Top Layer: 26.42,71.12 32.51,71.12 32.51,65.4 26.42,65.4
GND on Top Layer: 29.68,70.54 27.27,68.12 27.27,67.94 29.68,65.53 29.85,65.53 32.39,68.07 29.92,70.54
GND on Top Layer: 31.37,77.59 50.67,77.59 50.67,76.58 31.37,76.58
GND on Top Layer: 31.83,78.38 32.89,78.38 32.89,77.31 31.83,77.31
GND on Top Layer: -6.98,77.43 65.66,77.43 65.66,-4.73 -6.98,-4.73
GND on Bottom Layer: -17.04,77.48 75.29,77.48 75.29,-16.12 -17.04,-16.12

Small or netless copper shapes (teardrops, artwork), in the pictures only: 9 on Top Layer, 2 on Bottom Layer

## Text on the board
Top Silkscreen Layer: BAT- | BAT+ | FS | OFF | PA13 | PA12 | PA10 | PB17 | PB16 | PA4 | PA6 | PA3 | PA8 | PB9 | PB8 | GND | PA1 | ON | PA15 | 3V3 | PA5 | PA0 | PA2 | PA14 | PA11 | PA9 | PA7 | NFC_CTR | LED0 | LED1 | VCC | PB20 | PB22 | PB10 | PB12 | PB14 | PB18 | PB0 | PB2 | PB4 | PB6 | 5V | PB23 | PB19 | PB21 | PB1 | PB3 | PB5 | PB7 | PB11 | PB13 | PB15
